# Altium schematic sheet PowerSupply.SchDoc
size A4
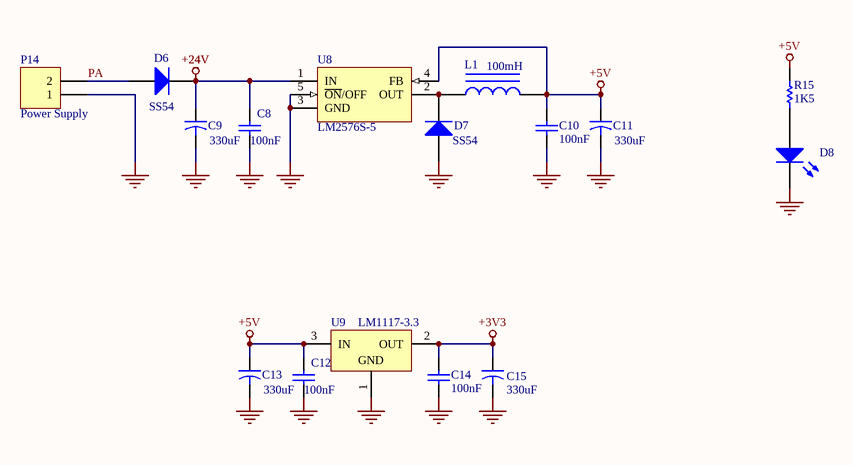
[diagram p0: PowerSupply.SchDoc]

## Parts
C8  value 100nF  [C-0805]  (hidden comment: 104)
C9  value 330uF  [C-ALU-10x10.2mm]  (hidden comment: 330uF/50V)
C10  value 100nF  [C-0805]  (hidden comment: 104)
C11  value 330uF  [C-ALU-10x10.2mm]  (hidden comment: 330uF/50V)
C12  value 100nF  [C-0805]  (hidden comment: 104)
C13  value 330uF  [C-ALU-10x10.2mm]  (hidden comment: 330uF/50V)
C14  value 100nF  [C-0805]  (hidden comment: 104)
C15  value 330uF  [C-ALU-10x10.2mm]  (hidden comment: 330uF/50V)
D6  value SS54  [D-DO214-AB]  (hidden comment: SS54-SMA)
D7  value SS54  [D-DO214-AB]  (hidden comment: SS54-SMA)
D8  SMD0805-RED  [LED-0805]  (value not drawn)
L1  value 100mH  [L-SMD-12.5x12.5]  (hidden comment: 100mH/3A)
P14  value Power Supply  [TER-KF128-2P]  (hidden comment: KF128-2P)
R15  1K5  [R-0805]
U8  LM2576S-5  [TO-263-5L]
U9  LM1117-3.3  [SOT-223-3]

## Nets
+3V3: C14.1 C15.1 U9.2(OUT)
+5V: C10.1 C11.1 C12.1 C13.1 L1.2 R15.2 U8.4(FB) U9.3(IN)
+24V: C8.1 C9.1 D6.2(K) U8.1(IN)
GND: C8.2 C9.2 C10.2 C11.2 C12.2 C13.2 C14.2 C15.2 D7.1(A) D8.2(K) P14.1 U8.3(GND) U8.5(~{ON}/OFF) U8.HM U9.1(GND)
PA: D6.1(A) P14.2
NetD7_2: D7.2(K) L1.1 U8.2(OUT)
NetD8_1: D8.1(A) R15.1

## Library data of the parts
C8 C10 C12 C14 = Cap: Capacitor; Published: 8-Jun-2000; LatestRevisionDate: 17-Jul-2002; LatestRevisionNote: Re-released for DXP Platform.; PackageReference: RAD-0.3; Publisher: Altium Limited
C9 C11 C13 C15 = Cap2: 100UF 50V 10x10.2MM; Published: 23-Sep-2002; PackageReference: CAPR5-4X5; Publisher: Altium Limited
D6 D7 = Diode 1N4004: 1 Amp General Purpose Rectifier; Published: 8-Jun-2000; LatestRevisionDate: 17-Jul-2002; LatestRevisionNote: Re-released for DXP Platform.; DatasheetDocument: 1998; PackageDocument: Aug-1999; PackageReference: DO-41; Code_JEDEC: DO-204-AL; ComponentLink1Description: Manufacturer Link; ComponentLink1URL: http://www.fairchildsemi.com/; ComponentLink2Description: Datasheet; ComponentLink2URL: http://www.fairchildsemi.com/ds/1N%2F1N4001.pdf
D8 = LED0: Typical INFRARED GaAs LED; Value: PowerLed; Published: 8-Jun-2000; LatestRevisionDate: 08-Jul-2005; LatestRevisionNote: Mech Layer 1 removed.; PackageReference: LED-0
L1 = Inductor Iron: Magnetic-Core Inductor; Published: 24-Mar-1999; LatestRevisionDate: 17-Jul-2002; LatestRevisionNote: Re-released for DXP Platform.; PackageReference: AXIAL-0.9; Publisher: Altium Limited; PackageDescription: Axial Device, Thru-Hole; 2 Leads; 0.9 in Pin Spacing
P14 = Header 2: Header, 2-Pin; LatestRevisionDate: 17-Jul-2002; LatestRevisionNote: Re-released for DXP Platform.
R15 = Res1: Resistor; Published: 8-Jun-2000; LatestRevisionDate: 17-Jul-2002; LatestRevisionNote: Re-released for DXP Platform.; PackageReference: AXIAL-0.3; Publisher: Altium Limited; PackageDescription: Axial Device, Thru-Hole; 2 Leads; 0.3 in Pin Spacing; Value: 1K5
U8 = LM2576S-5.0: Simple Switcher 3A Step Down Voltage Regulator; Note: Tab is connected to GND; Published: 15-Apr-2002; DatasheetVersion: Jun-1999; PackageReference: TS5B; Publisher: Altium Limited; PackageDescription: D2-PAK; 5 Leads; Body 14.4 (inc. leads) x 10.4 mm (LxW max); ComponentLink1Description: Manufacturer Link; ComponentLink1URL: http://www.national.com/; ComponentLink2Description: Datasheet; ComponentLink2URL: http://www.national.com/ds.cgi/LM/LM2576.pdf; ComponentLink3Description: URL Link1; ComponentLink3URL: http://www.national.com/pf/LM/LM2576.html
U9 = LM1117DT-3.3: 800mA Low-Dropout Linear Regulator, 3-pin TO-252; Manufacturer: National Semiconductor; PackageTopMarking: NSUZXYTT*LM1117*DT-3.3; PowerWise: N; CompType: LDO IC; Published: 4-Dec-2008; DatasheetVersion: Apr-2006; PackageVersion: revD, Feb-2009; PackageReference: TD03B; Publisher: Altium Limited; PackageDescription: TO252, Molded, Jedec, 6.8 x 6.10 x 2.30mm Body, 3 Lead, 2.28mm Pitch, Surface Mount; Supplier 1: Farnell; Supplier Part Number 1: 9486275; Supplier 2: Farnell; Supplier Part Number 2: 1523829; PartNumber: LM1117DT-3.3; RoHS: N; PinCount: 3; Code_JEDEC: TO-252-AA; ComponentLink1Description: LM1117 Datasheet; ComponentLink1URL: http://www.national.com/ds/LM/LM1117.pdf; ComponentLink2Description: LM1117 Web Page; ComponentLink2URL: http://www.national.com/pf/LM/LM1117.html; ComponentLink3Description: TD03B Package Page; ComponentLink3URL: http://www.national.com/packaging/folders/td03b.html; Value: LM1117-3.3